# Altium schematic sheet stepper.SchDoc
size A4
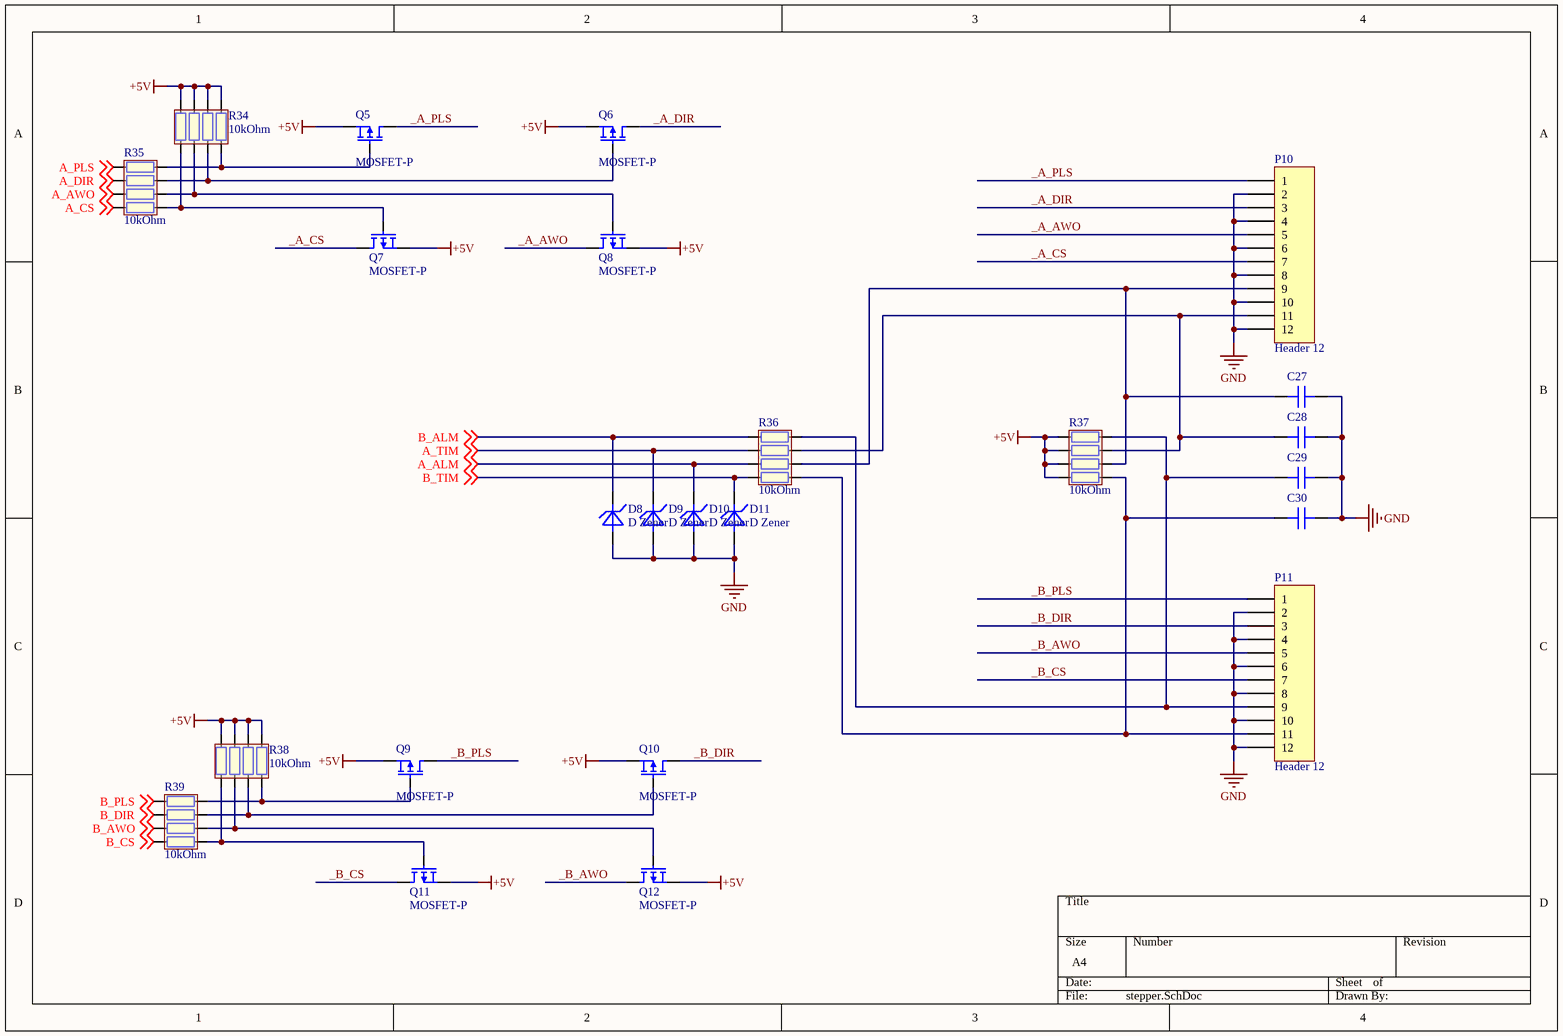
[diagram p0: stepper.SchDoc]

## Parts
C27  100nF  [CAP 0805]  (value not drawn)
C28  100nF  [CAP 0805]  (value not drawn)
C29  100nF  [CAP 0805]  (value not drawn)
C30  100nF  [CAP 0805]  (value not drawn)
D8  D Zener  [CD3216-1206]
D9  D Zener  [CD3216-1206]
D10  D Zener  [CD3216-1206]
D11  D Zener  [CD3216-1206]
P10  Header 12  [MOLEX 53426-1210]
P11  Header 12  [MOLEX 53426-1210]
Q5  MOSFET-P  [SOT23-3]
Q6  MOSFET-P  [SOT23-3]
Q7  MOSFET-P  [SOT23-3]
Q8  MOSFET-P  [SOT23-3]
Q9  MOSFET-P  [SOT23-3]
Q10  MOSFET-P  [SOT23-3]
Q11  MOSFET-P  [SOT23-3]
Q12  MOSFET-P  [SOT23-3]
R34  10kOhm  [RES 0603 4PACK]
R35  10kOhm  [RES 0603 4PACK]
R36  10kOhm  [RES 0603 4PACK]
R37  10kOhm  [RES 0603 4PACK]
R38  10kOhm  [RES 0603 4PACK]
R39  10kOhm  [RES 0603 4PACK]

## Nets
+5V: Q5.2(S) Q6.2(S) Q7.2(S) Q8.2(S) Q9.2(S) Q10.2(S) Q11.2(S) Q12.2(S) R34.5 R34.6 R34.7 R34.8 R37.5 R37.6 R37.7 R37.8 R38.5 R38.6 R38.7 R38.8
GND: C27.2 C28.2 C29.2 C30.2 D8.1 D9.1 D10.1 D11.1 P10.2 P10.4 P10.6 P10.8 P10.10 P10.12 P11.2 P11.4 P11.6 P11.8 P11.10 P11.12
_A_AWO: P10.5 Q8.3(D)
_A_CS: P10.7 Q7.3(D)
_A_DIR: P10.3 Q6.3(D)
_A_PLS: P10.1 Q5.3(D)
_B_AWO: P11.5 Q12.3(D)
_B_CS: P11.7 Q11.3(D)
_B_DIR: P11.3 Q10.3(D)
_B_PLS: P11.1 Q9.3(D)
A_ALM: D10.2 R36.6 ; off-sheet A_ALM
A_AWO: R35.6 ; off-sheet A_AWO
A_CS: R35.5 ; off-sheet A_CS
A_DIR: R35.7 ; off-sheet A_DIR
A_PLS: R35.8 ; off-sheet A_PLS
A_TIM: D9.2 R36.7 ; off-sheet A_TIM
B_ALM: D8.2 R36.8 ; off-sheet B_ALM
B_AWO: R39.6 ; off-sheet B_AWO
B_CS: R39.5 ; off-sheet B_CS
B_DIR: R39.7 ; off-sheet B_DIR
B_PLS: R39.8 ; off-sheet B_PLS
B_TIM: D11.2 R36.5 ; off-sheet B_TIM
NetC27_1: C27.1 P10.9 R36.3 R37.2
NetC28_1: C28.1 P10.11 R36.2 R37.3
NetC29_1: C29.1 P11.9 R36.1 R37.4
NetC30_1: C30.1 P11.11 R36.4 R37.1
NetQ5_1: Q5.1(G) R34.4 R35.1
NetQ6_1: Q6.1(G) R34.3 R35.2
NetQ7_1: Q7.1(G) R34.1 R35.4
NetQ8_1: Q8.1(G) R34.2 R35.3
NetQ9_1: Q9.1(G) R38.4 R39.1
NetQ10_1: Q10.1(G) R38.3 R39.2
NetQ11_1: Q11.1(G) R38.1 R39.4
NetQ12_1: Q12.1(G) R38.2 R39.3

## Library data of the parts
C27-C30 = Cap: Non-polar capacitor; Published: 8-Jun-2000; LatestRevisionDate: 17-Jul-2002; LatestRevisionNote: Re-released for DXP Platform.; PackageReference: RAD-0.3; Publisher: Altium Limited; PackageDescription: Radial Cap, Thru-Hole; 2 Leads; 0.3 in Pin Spacing
D8-D11 = DZ: Zener Diode; Published: 8-Jun-2000; LatestRevisionDate: 17-Jul-2002; LatestRevisionNote: Re-released for DXP Platform.; PackageReference: DIODE-0.7; Publisher: Altium Limited; PackageDescription: Diode, Thru-Hole; 2 Leads; 0.7 in Pin Spacing
P10 P11 = Header 12: Header, 12-Pin; LatestRevisionDate: 17-Jul-2002; LatestRevisionNote: Re-released for DXP Platform.; Publisher: Altium Limited
Q5-Q12 = MOSFET-P: P-Channel MOSFET; Published: 8-Jun-2000; LatestRevisionDate: 17-Jul-2002; LatestRevisionNote: Re-released for DXP Platform.; PackageVersion: 1995/1996; PackageReference: E3; Publisher: Altium Limited; PackageDescription: TO, Flat Index; 3 In-Line, Axial Leads; Body Dia. 4.6mm; Lead Dia. 0.5 mm (max)
R34-R39 = Res 4Pack